# EAGLE schematic Half Bridge (EAGLE 7.2.0)
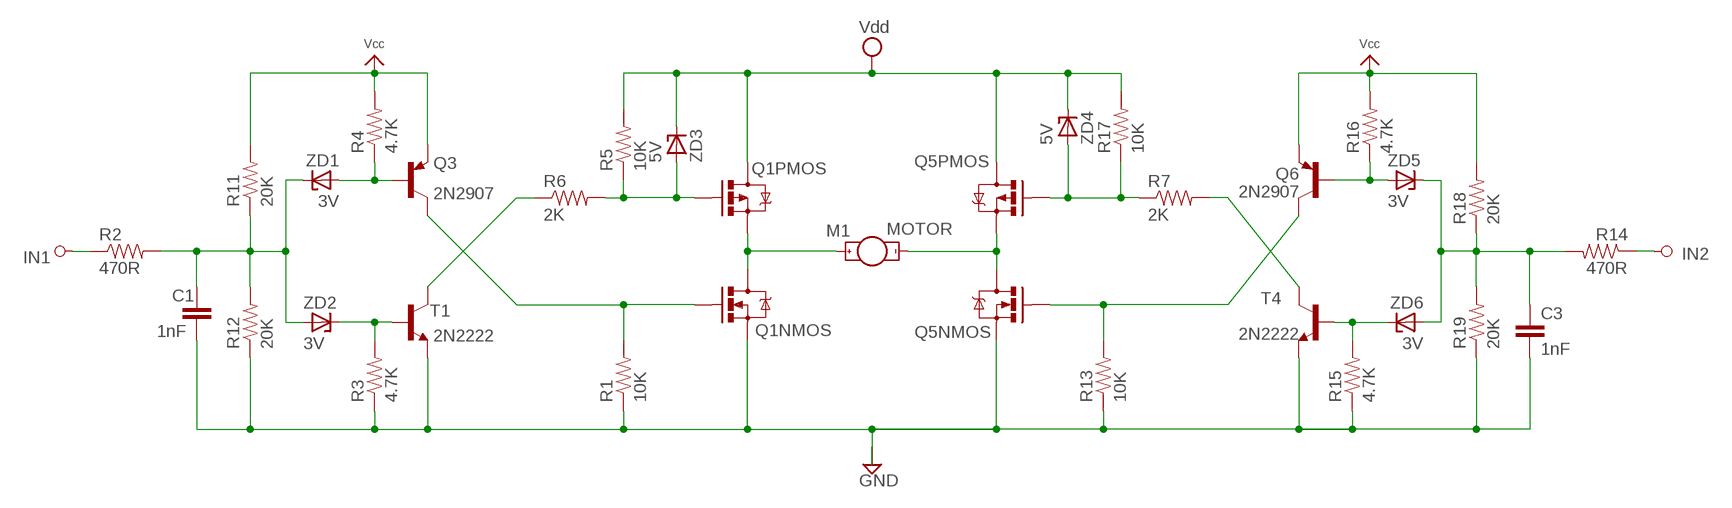
[diagram p0: schematic, sheet 1]

## Parts
C1  1nF  CAP0805  [0805]
C3  1nF  CAP0805  [0805]
IN1  IN1  PAD_TERMINAL-4.1MMROUND  [PAD_ROUND_4.1MM]
IN2  PAD_TERMINAL-4.1MMROUND  [PAD_ROUND_4.1MM]
M1  MOTOR  MOTOR10MM  [VIBE-MOTOR-10MM]
Q1  IRF7509  [MSOP8]
Q3  2N2907  [TO92-EBC-OVAL]
Q5  IRF7509  [MSOP8]
Q6  2N2907  [TO92-EBC-OVAL]
R1  10K  RESISTOR0805-RES  [0805]
R2  470R  RESISTOR0805-RES  [0805]
R3  4.7K  RESISTOR0805-RES  [0805]
R4  4.7K  RESISTOR0805-RES  [0805]
R5  10K  RESISTOR0805-RES  [0805]
R6  2K  RESISTOR0805-RES  [0805]
R7  2K  RESISTOR0805-RES  [0805]
R11  20K  RESISTOR0805-RES  [0805]
R12  20K  RESISTOR0805-RES  [0805]
R13  10K  RESISTOR0805-RES  [0805]
R14  470R  RESISTOR0805-RES  [0805]
R15  4.7K  RESISTOR0805-RES  [0805]
R16  4.7K  RESISTOR0805-RES  [0805]
R17  10K  RESISTOR0805-RES  [0805]
R18  20K  RESISTOR0805-RES  [0805]
R19  20K  RESISTOR0805-RES  [0805]
T1  2N2222  [TO92-EBC-OVAL]
T4  2N2222  [TO92-EBC-OVAL]
ZD1  3V  ZENERSOD-123  [SOD-123]
ZD2  3V  ZENERSOD-123  [SOD-123]
ZD3  5V  ZENERSOD-123  [SOD-123]
ZD4  5V  ZENERSOD-123  [SOD-123]
ZD5  3V  ZENERSOD-123  [SOD-123]
ZD6  3V  ZENERSOD-123  [SOD-123]

## Nets
GND: C1.2 C3.2 Q1.1(NMOS:S) Q5.1(NMOS:S) R1.1 R3.1 R12.1 R13.1 R15.1 R19.1 T1.E T4.E
N$2: R3.2 T1.B ZD2.C
N$3: Q3.B R4.1 ZD1.A
N$4: Q1.2(NMOS:G) Q3.C R1.2
N$5: Q1.4(PMOS:G) R5.1 R6.2 ZD3.A
N$6: IN1.P R2.1
N$8: R15.2 T4.B ZD6.C
N$9: C1.1 R2.2 R11.1 R12.2 ZD1.C ZD2.A
N$10: M1.+ Q1.3(PMOS:S) Q1.7(NMOS:D) Q1.8(NMOS:D)
N$11: Q6.B R16.1 ZD5.A
N$12: Q5.2(NMOS:G) Q6.C R13.2
N$13: Q5.4(PMOS:G) R7.1 R17.1 ZD4.A
N$14: C3.1 R14.2 R18.1 R19.2 ZD5.C ZD6.A
N$15: M1.- Q5.3(PMOS:S) Q5.7(NMOS:D) Q5.8(NMOS:D)
N$16: IN2.P R14.1
N$17: R6.1 T1.C
N$18: R7.2 T4.C
VCC: Q1.5(PMOS:D) Q1.6(PMOS:D) Q3.E Q5.5(PMOS:D) Q5.6(PMOS:D) Q6.E R4.2 R5.2 R11.2 R16.2 R17.2 R18.2 ZD3.C ZD4.C ; supply symbol labelled Vcc, Vdd

## Library data of the parts
C1 C3 = ATtami:CAP: Capacitor Standard 0603 ceramic capacitor, and 0.1" leaded capacitor.
IN1 IN2 = dp_devices:PAD_TERMINAL: Terminal connection pad
M1 = SparkFun-Electromechanical:MOTOR: Vibration Motor- ROB-08449 Physical dimension and wire connections for this powerful vibration motor. Motor has a self adhesive backing.
Q1 Q5 = SparkFun-DiscreteSemi:IRF7509: 30V Dual PMOS/NMOS MSOP-8 NMOS RDS .11-ohm PMOS RDS .20-ohm TRANS-07913; PROD_ID: TRANS-07913
Q3 Q6 = adafruit:2N2907*: PNP Transistor Big Oval pads
R1-R7 R11-R19 = ATtami:RESISTOR: Resistor Basic schematic elements and footprints for 0603, 1206, and PTH resistors.
T1 T4 = adafruit:2N2222: NPN TRANSISTOR Big oval pads
ZD1-ZD6 = ATTiny Fuse Reset with 12V Charge Pump:ZENER: Zener Diode SOD-323